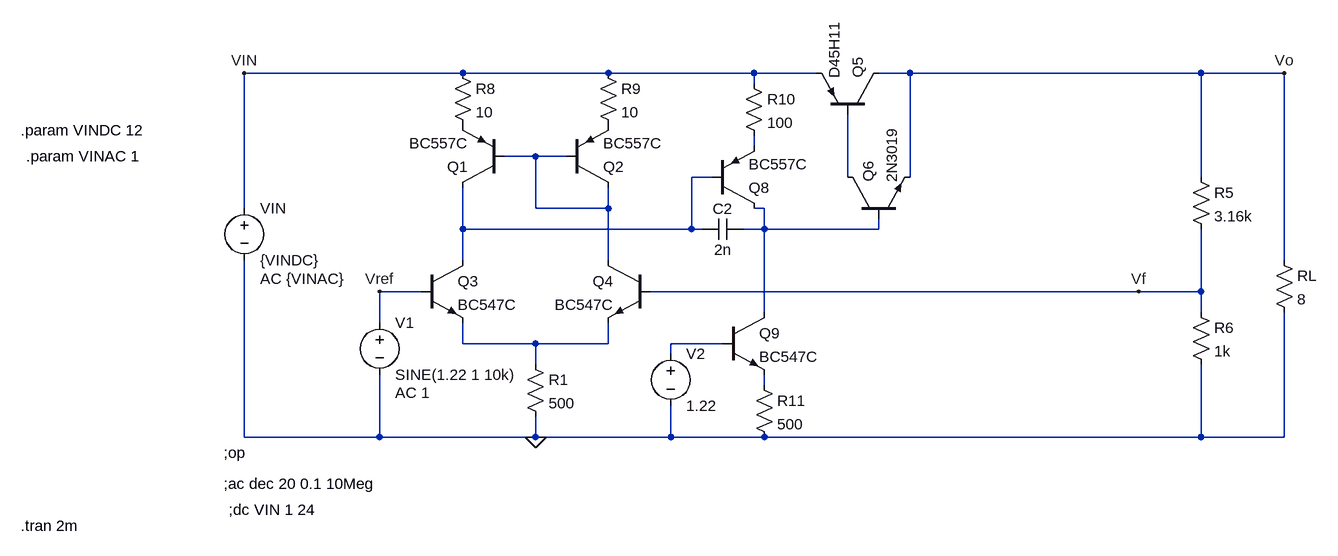
[diagram p0: schematic Regulador_Lineal_version5_1.asc]
Regulador_Lineal_version5_1.asc, the LTspice schematic file:
Version 4
SHEET 1 2168 680
WIRE 96 -32 -240 -32
WIRE 320 -32 96 -32
WIRE 544 -32 320 -32
WIRE 640 -32 544 -32
WIRE 784 -32 736 -32
WIRE 1232 -32 784 -32
WIRE 1360 -32 1232 -32
WIRE 544 -16 544 -32
WIRE 544 80 544 64
WIRE 208 96 160 96
WIRE 256 96 208 96
WIRE 480 128 448 128
WIRE 688 128 688 32
WIRE 784 128 784 -32
WIRE 1232 128 1232 -32
WIRE -240 176 -240 -32
WIRE 208 176 208 96
WIRE 320 176 320 144
WIRE 320 176 208 176
WIRE 560 176 544 176
WIRE 96 208 96 144
WIRE 448 208 448 128
WIRE 448 208 96 208
WIRE 464 208 448 208
WIRE 560 208 560 176
WIRE 560 208 528 208
WIRE 736 208 736 192
WIRE 736 208 560 208
WIRE 96 256 96 208
WIRE 320 256 320 176
WIRE 1360 256 1360 -32
WIRE 32 304 -32 304
WIRE 1136 304 384 304
WIRE 1232 304 1232 208
WIRE 1232 304 1136 304
WIRE 560 336 560 208
WIRE 1232 336 1232 304
WIRE -32 352 -32 304
WIRE 96 384 96 352
WIRE 208 384 96 384
WIRE 320 384 320 352
WIRE 320 384 208 384
WIRE 496 384 416 384
WIRE 416 400 416 384
WIRE 208 416 208 384
WIRE 560 448 560 432
WIRE -240 528 -240 256
WIRE -32 528 -32 432
WIRE -32 528 -240 528
WIRE 208 528 208 496
WIRE 208 528 -32 528
WIRE 416 528 416 480
WIRE 416 528 208 528
WIRE 560 528 416 528
WIRE 1232 528 1232 416
WIRE 1232 528 560 528
WIRE 1360 528 1360 336
WIRE 1360 528 1232 528
FLAG 208 528 0
FLAG 1360 -32 Vo
FLAG -32 304 Vref
FLAG -240 -32 VIN
FLAG 1136 304 Vf
DATAFLAG 1200 -32 ""
DATAFLAG 624 304 ""
SYMBOL pnp 160 144 R180
SYMATTR InstName Q1
SYMATTR Value BC557C
SYMBOL pnp 256 144 M180
SYMATTR InstName Q2
SYMATTR Value BC557C
SYMBOL npn 32 256 R0
SYMATTR InstName Q3
SYMATTR Value BC547C
SYMBOL npn 384 256 M0
SYMATTR InstName Q4
SYMATTR Value BC547C
SYMBOL res 192 400 R0
SYMATTR InstName R1
SYMATTR Value 500
SYMBOL pnp 736 32 M270
SYMATTR InstName Q5
SYMATTR Value D45H11
SYMBOL npn 688 192 R270
SYMATTR InstName Q6
SYMATTR Value 2N3019
SYMBOL res 1216 112 R0
SYMATTR InstName R5
SYMATTR Value 3.16k
SYMBOL res 1216 320 R0
SYMATTR InstName R6
SYMATTR Value 1k
SYMBOL res 1344 240 R0
SYMATTR InstName RL
SYMATTR Value 8
SYMBOL voltage -32 336 R0
WINDOW 123 24 124 Left 2
WINDOW 39 0 0 Left 0
SYMATTR Value2 AC 1
SYMATTR InstName V1
SYMATTR Value SINE(1.22 1 10k)
SYMBOL voltage -240 160 R0
WINDOW 123 24 124 Left 2
WINDOW 39 0 0 Left 0
SYMATTR Value2 AC {VINAC}
SYMATTR InstName VIN
SYMATTR Value {VINDC}
SYMBOL res 80 -48 R0
SYMATTR InstName R8
SYMATTR Value 10
SYMBOL res 304 -48 R0
SYMATTR InstName R9
SYMATTR Value 10
SYMBOL pnp 480 176 M180
SYMATTR InstName Q8
SYMATTR Value BC557C
SYMBOL res 528 -32 R0
SYMATTR InstName R10
SYMATTR Value 100
SYMBOL cap 528 192 R90
WINDOW 0 0 32 VBottom 2
WINDOW 3 32 32 VTop 2
SYMATTR InstName C2
SYMATTR Value 2n
SYMATTR SpiceLine Rser=1k
SYMBOL npn 496 336 R0
SYMATTR InstName Q9
SYMATTR Value BC547C
SYMBOL res 544 432 R0
SYMATTR InstName R11
SYMATTR Value 500
SYMBOL voltage 416 384 R0
WINDOW 123 0 0 Left 0
WINDOW 39 0 0 Left 0
SYMATTR InstName V2
SYMATTR Value 1.22
TEXT -272 552 Left 2 !;op
TEXT -272 600 Left 2 !;ac dec 20 0.1 10Meg
TEXT -264 640 Left 2 !;dc VIN 1 24
TEXT -584 56 Left 2 !.param VINDC 12
TEXT -576 96 Left 2 !.param VINAC 1
TEXT -584 664 Left 2 !.tran 2m

The netlist it stands for:
* Regulador_Lineal_version5_1.asc
Q1 N003 N002 P001 0 BC557C
Q2 N002 N002 P002 0 BC557C
Q3 N003 Vref N006 0 BC547C
Q4 N002 Vf N006 0 BC547C
R1 N006 0 500
Q5 Vo N004 VIN 0 D45H11
Q6 N004 N005 Vo 0 2N3019
R5 Vo Vf 3.16k
R6 Vf 0 1k
RL Vo 0 8
V1 Vref 0 SINE(1.22 1 10k) AC 1
VIN VIN 0 {VINDC} AC {VINAC}
R8 VIN P001 10
R9 VIN P002 10
Q8 N005 N003 N001 0 BC557C
R10 VIN N001 100
C2 N005 N003 2n Rser=1k
Q9 N005 N007 N008 0 BC547C
R11 N008 0 500
V2 N007 0 1.22
.model NPN NPN
.model PNP PNP
.lib standard.bjt
;op
;ac dec 20 0.1 10Meg
;dc VIN 1 24
.param VINDC 12
.param VINAC 1
.tran 2m
.backanno
.end